# EAGLE design dekatron-sim-4017-a3 (EAGLE 7.3.0)
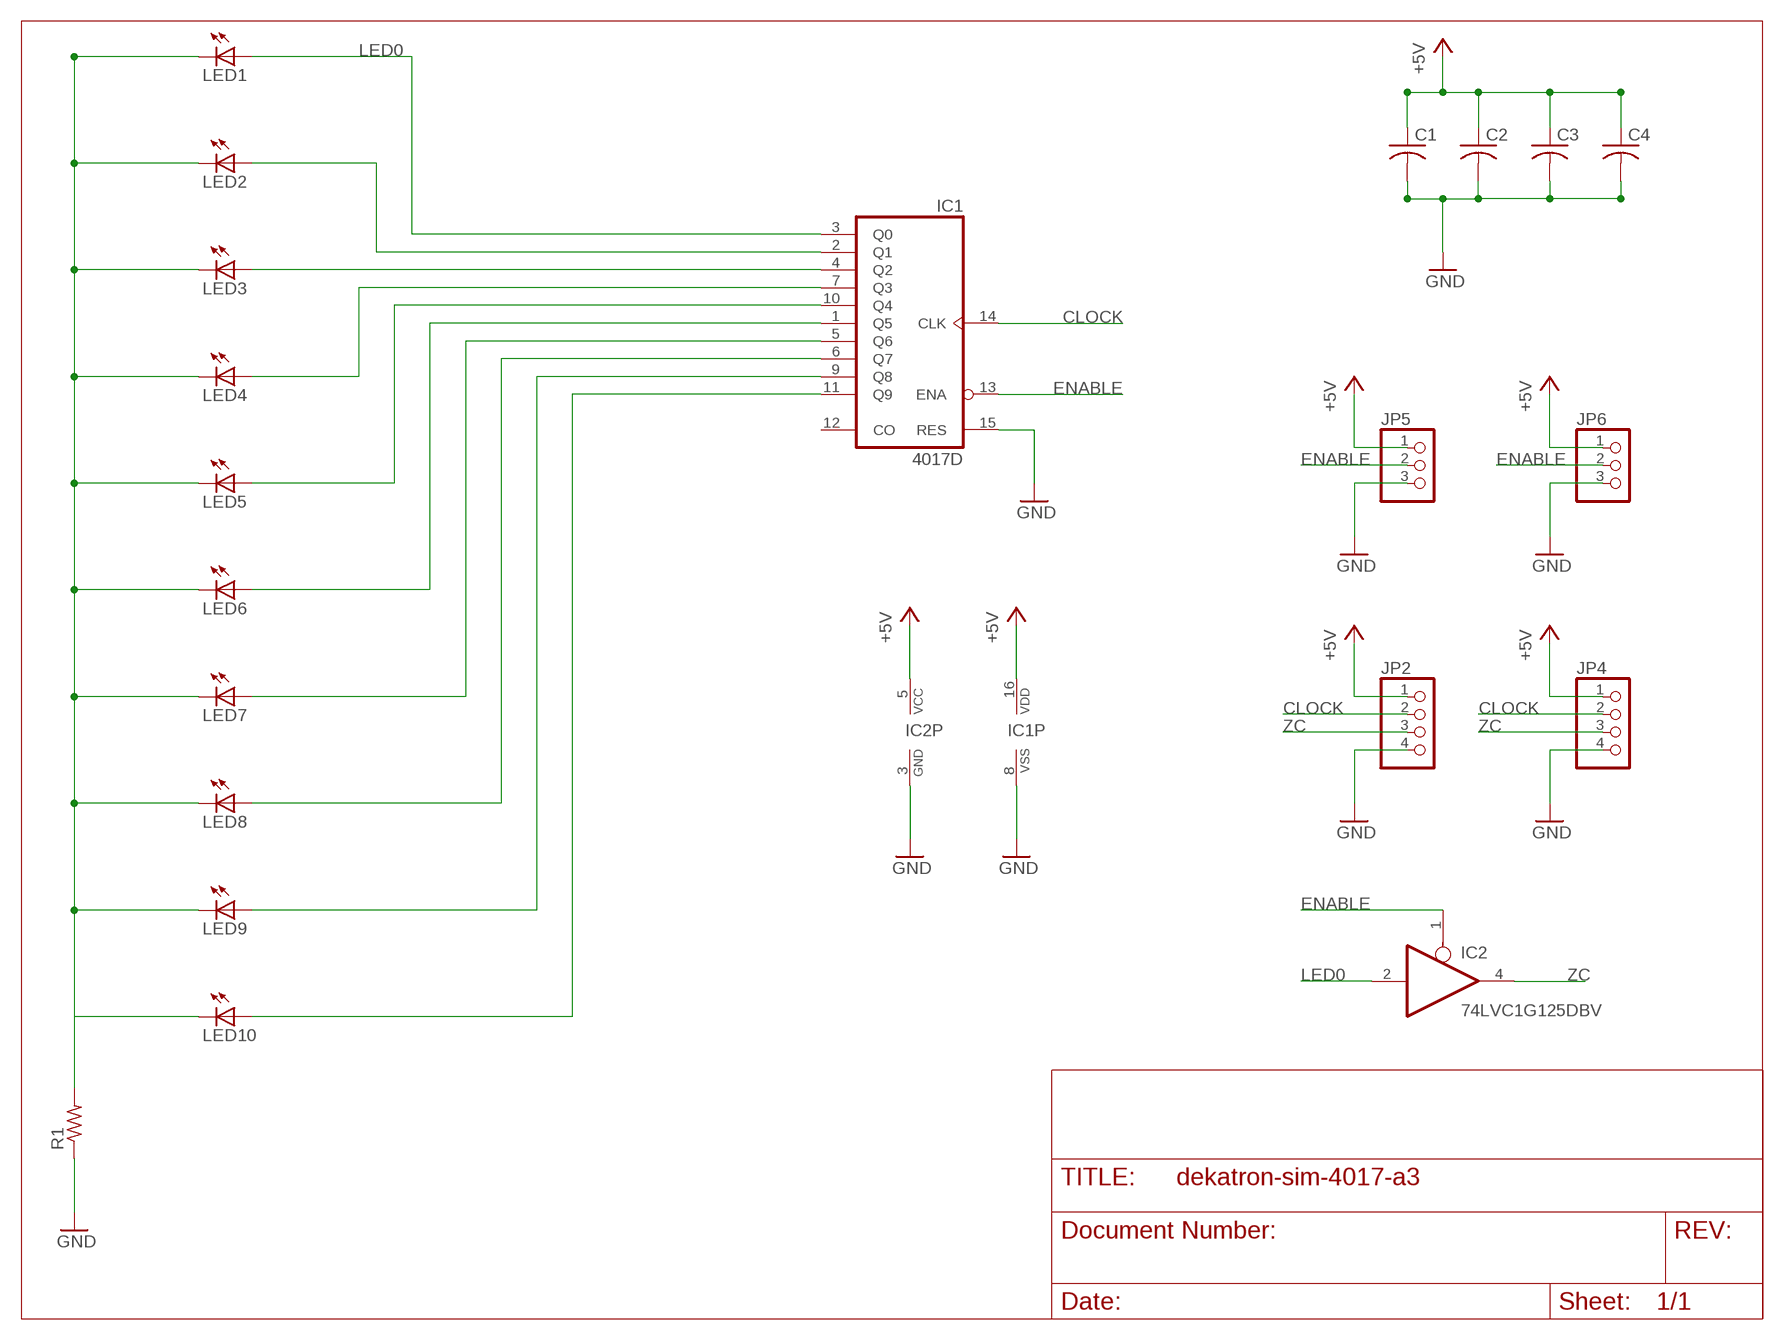
[diagram p0: schematic, sheet 1]

## Parts
C1  C-USC0805  [C0805]
C2  C-USC0805  [C0805]
C3  C-USC0805  [C0805]
C4  C-USC0805  [C0805]
IC1  4017D  [SO16]
IC2  74LVC1G125DBV  [SOT23-5]
JP2  PINHD-1X4  [1X04]
JP4  PINHD-1X4  [1X04]
JP5  PINHD-1X3  [1X03]
JP6  PINHD-1X3  [1X03]
LED1  RED  LEDCHIP-LED0805  [CHIP-LED0805]
LED2  RED  LEDCHIP-LED0805  [CHIP-LED0805]
LED3  RED  LEDCHIP-LED0805  [CHIP-LED0805]
LED4  RED  LEDCHIP-LED0805  [CHIP-LED0805]
LED5  RED  LEDCHIP-LED0805  [CHIP-LED0805]
LED6  RED  LEDCHIP-LED0805  [CHIP-LED0805]
LED7  RED  LEDCHIP-LED0805  [CHIP-LED0805]
LED8  RED  LEDCHIP-LED0805  [CHIP-LED0805]
LED9  RED  LEDCHIP-LED0805  [CHIP-LED0805]
LED10  RED  LEDCHIP-LED0805  [CHIP-LED0805]
R1  R-US_R0805  [R0805]

## Nets
+5V: C1.1 C2.1 C3.1 C4.1 IC1.16(VDD) IC2.5(VCC) JP2.1 JP4.1 JP5.1 JP6.1
CLOCK: IC1.14(CLK) JP2.2 JP4.2
ENABLE: IC1.13(ENA) IC2.1(OE) JP5.2 JP6.2
GND: C1.2 C2.2 C3.2 C4.2 IC1.8(VSS) IC1.15(RES) IC2.3(GND) JP2.4 JP4.4 JP5.3 JP6.3 R1.1
LED0: IC1.3(Q0) IC2.2(I) LED1.A
LED1: IC1.2(Q1) LED2.A
LED3: IC1.7(Q3) LED4.A
LED4: IC1.10(Q4) LED5.A
LED5: IC1.1(Q5) LED6.A
LED6: IC1.5(Q6) LED7.A
LED7: IC1.6(Q7) LED8.A
LED8: IC1.9(Q8) LED9.A
LED9: IC1.11(Q9) LED10.A
LED_SINK: LED1.C LED2.C LED3.C LED4.C LED5.C LED6.C LED7.C LED8.C LED9.C LED10.C R1.2
N$1: IC1.4(Q2) LED3.A
ZC: IC2.4(O) JP2.3 JP4.3
Unconnected: IC1.12(CO)

## Library data of the parts
C1-C4 = resistor:C-US: CAPACITOR, American symbol
IC1 = 40xx:4017: COUNTER/DIVIDER
IC2 = 74xx-little-us:74*1G125: Single Bus Buffer Gate with 3-State Output
JP2 JP4 = pinhead:PINHD-1X4: PIN HEADER
JP5 JP6 = pinhead:PINHD-1X3: PIN HEADER
LED1-LED10 = led:LED: LED OSRAM: - CHIPLED LG R971, LG N971, LY N971, LG Q971, LY Q971, LO R971, LY R971 LH N974, LH R974 LS Q976, LO Q976, LY Q976 LO Q996 - Hyper CHIPLED LW Q18S LB Q993, LB Q99A, LB R99A - SideLED LS A670, LO A670, LY A670, LG A670, LP A670 LB A673, LV A673, LT A673, LW A673 LH A674 LY A675 LS A676, LA A676, LO A676, LY A676, LW A676 LS A679, LY A679, LG A679 - Hyper Micro SIDELED® LS Y876, LA Y876, LO Y876, LY Y876 LT Y87S - SmartLED LW L88C, LW L88S LB L89C, LB L89S, LG L890 LS L89K, LO L89K, LY L89K LS L896, LA L896, LO L896, LY L896 - TOPLED LS T670, LO T670, LY T670, LG T670, LP T670 LSG T670, LSP T670, LSY T670, LOP T670, LYG T670 LG T671, LOG T671, LSG T671 LB T673, LV T673, LT T673, LW T673 LH T674 LS T676, LA T676, LO T676, LY T676, LB T676, LH T676, LSB T676, LW T676 LB T67C, LV T67C, LT T67C, LS T67K, LO T67K, LY T67K, LW E67C LS E67B, LA E67B, LO E67B, LY E67B, LB E67C, LV E67C, LT E67C LW T67C LS T679, LY T679, LG T679 LS T770, LO T770, LY T770, LG T770, LP T770 LB T773, LV T773, LT T773, LW T773 LH T774 LS E675, LA E675, LY E675, LS T675 LS T776, LA T776, LO T776, LY T776, LB T776 LHGB T686 LT T68C, LB T68C - Hyper Mini TOPLED® LB M676 - Mini TOPLED Santana® LG M470 LS M47K, LO M47K, LY M47K Source: http://www.osram.convergy.de LUXEON: - LUMILED® LXK2-PW12-R00, LXK2-PW12-S00, LXK2-PW14-U00, LXK2-PW14-V00 LXK2-PM12-R00, LXK2-PM12-S00, LXK2-PM14-U00 LXK2-PE12-Q00, LXK2-PE12-R00, LXK2-PE12-S00, LXK2-PE14-T00, LXK2-PE14-U00 LXK2-PB12-K00, LXK2-PB12-L00, LXK2-PB12-M00, LXK2-PB14-N00, LXK2-PB14-P00, LXK2-PB14-Q00 LXK2-PR12-L00, LXK2-PR12-M00, LXK2-PR14-Q00, LXK2-PR14-R00 LXK2-PD12-Q00, LXK2-PD12-R00, LXK2-PD12-S00 LXK2-PH12-R00, LXK2-PH12-S00 LXK2-PL12-P00, LXK2-PL12-Q00, LXK2-PL12-R00 Source: www.luxeon.com KINGBRIGHT: KA-3528ASYC Source: www.kingbright.com
R1 = resistor:R-US_: RESISTOR, American symbol

## Board
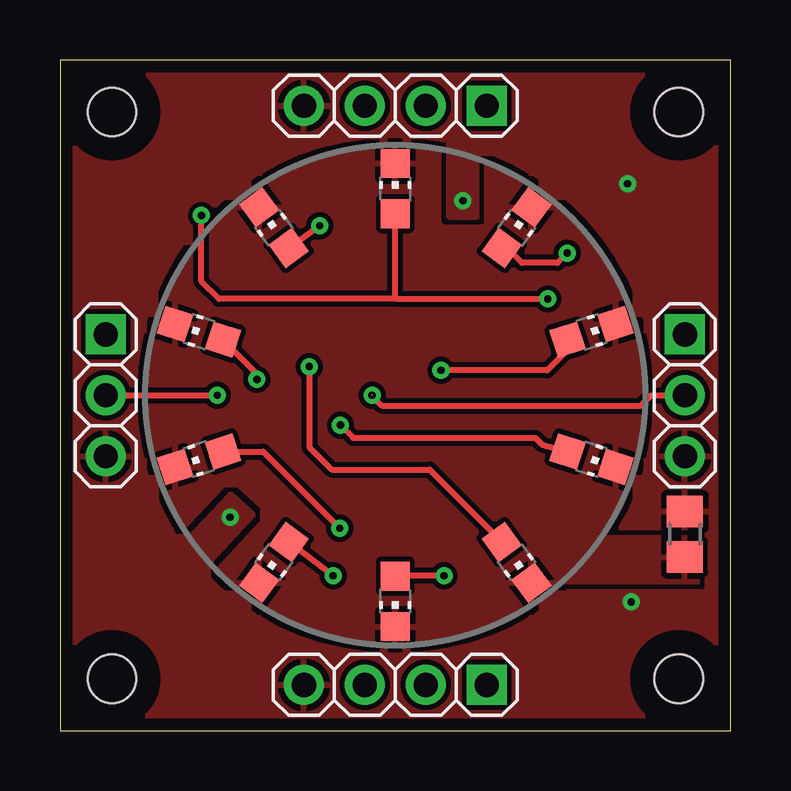
[diagram p1: board, top side]
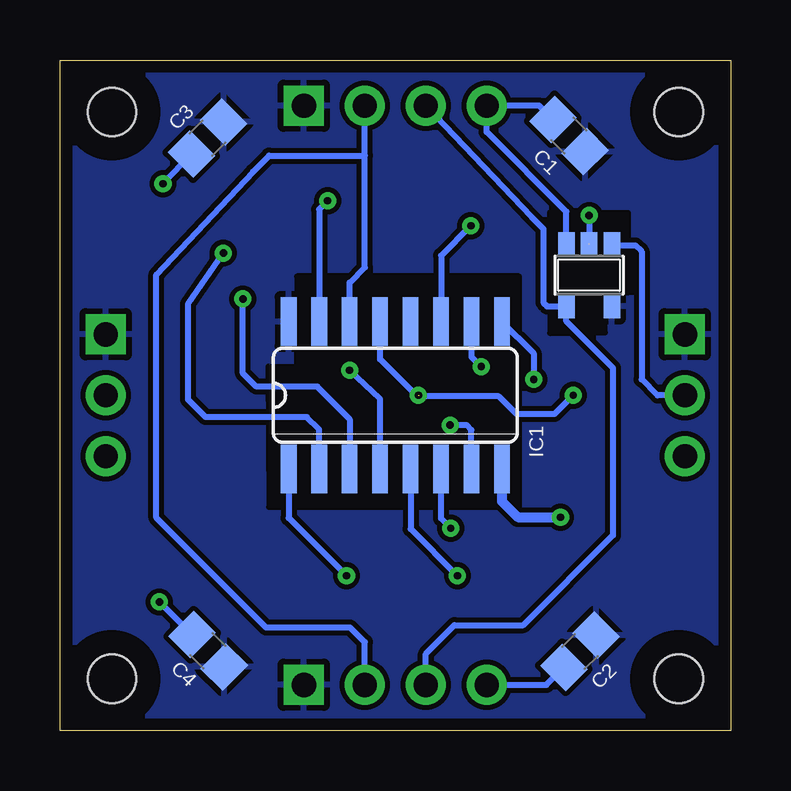
[diagram p2: board, bottom side, seen from below]

Size 27.94 x 27.94 mm. Coordinates in mm from the lower left corner, seen from the top.
Outline: 27.94,27.94 0,27.94 0,0 27.94,0 27.94,27.94
Copper layers (1*16): Top 0.035mm / dielectric 1.5mm / Bottom 0.035mm
Design rules "default *": minimum track width 8mil, minimum drill 12mil, track to track 8mil, track to pad 10mil, pad to pad 10mil, via to via 8mil, smd to smd 8mil, copper to edge 20mil, drill to drill 8mil, minimum pad ring 10mil, minimum via ring 8mil, stop-mask expansion 4mil, vias tented up to drill 0mil, thermal gap 10mil
Holes 2.01 mm at 2.16,2.16 25.78,2.16 25.78,25.78 2.16,25.78
tRestrict: area 23.8,0.2 to 27.8,4.2; area 23.8,23.8 to 27.8,27.8; area 0.2,23.8 to 4.2,27.8; area 0.2,0.2 to 4.2,4.2
bRestrict: area 23.8,0.2 to 27.8,4.2; area 23.8,23.8 to 27.8,27.8; area 0.2,23.8 to 4.2,27.8; area 0.2,0.2 to 4.2,4.2; area 8.8,9.3 to 19.3,18.9; area 4.3,16.6 to 7.5,21.6

### Footprints (pad centres in the part's own frame; a part is rotated, then mirrored left to right if it is on the bottom)
C0805 = smd 1.3 x 1.5: 1 -0.95,0; 2 0.95,0
SO16 = smd 0.66 x 2.032: 1 -4.445,-3.073; 2 -3.175,-3.073; 3 -1.905,-3.073; 4 -0.635,-3.073; 5 0.635,-3.073; 6 1.905,-3.073; 7 3.175,-3.073; 8 4.445,-3.073; 9 4.445,3.073; 10 3.175,3.073; 11 1.905,3.073; 12 0.635,3.073; 13 -0.635,3.073; 14 -1.905,3.073; 15 -3.175,3.073; 16 -4.445,3.073
SOT23-5 = smd 0.69 x 0.99: 1 -0.95,-1.29; 2 0,-1.29; 3 0.95,-1.29; 4 0.95,1.3; 5 -0.95,1.3
1X04 = drill 1.016 pad 1.676 square: 1 -3.81,0 | drill 1.016 pad 1.676: 2 -1.27,0; 3 1.27,0; 4 3.81,0
1X03 = drill 1.016 pad 1.676 square: 1 -2.54,0 | drill 1.016 pad 1.676: 2 0,0; 3 2.54,0
CHIP-LED0805 = smd 1.2 x 1.2: A 0,-1.05; C 0,1.05
R0805 = smd 1.3 x 1.5: 1 -0.95,0; 2 0.95,0

### Placement (x,y rotation side)
C1  6.73,24.79 135 bottom
C2  6.27,3.3 225 bottom
C3  21.79,24.69 225 bottom
C4  21.77,3.33 135 bottom
IC1  13.97,13.97 0 bottom
IC2  5.89,18.97 180 bottom
JP2  13.97,26.04 180 top
JP4  13.97,1.91 180 top
JP5  1.91,13.97 270 top
JP6  26.04,13.97 270 top
LED1  13.97,22.58 0 top
LED2  19.02,20.95 324 top
LED3  22.15,16.61 288 top
LED4  22.15,11.3 252 top
LED5  19.02,7.01 216 top
LED6  13.97,5.38 180 top
LED7  8.92,7.01 144 top
LED8  5.79,11.3 108 top
LED9  5.79,16.61 72 top
LED10  8.92,20.95 36 top
R1  26.04,8.18 270 top

### Tracks (layer width: path | path; a pad name or v marks a point on that pad's centre or on a via)
+5V
  pour Bottom: 27.69,0.25 0.25,0.25 0.25,27.69 27.69,27.69
CLOCK
  Bottom 0.254: JP4.2 15.24,3.68 15.85,4.29 19.36,4.29 23.93,8.87 23.93,19 19.89,23.29 19.23,23.95 15.24,23.95 | IC1.14 15.88,18.67 15.24,19.3 15.24,23.95 | 15.24,23.95 JP2.2
ENABLE  (via drill 0.3)  (1 unrouted)
  Top 0.254: JP5.2 v6.55,13.97 | 12.98,13.97 13.41,13.54 24.21,13.54 24.64,13.97 JP6.2
  Bottom 0.254: IC2.1 4.9,20.22 3.96,20.22 3.71,19.96 3.71,14.63 3.05,13.97 JP5.2 | IC1.13 14.61,15.47 13.11,13.97 v13.01,13.97 12.95,13.92 9.65,13.92 8.91,13.18 7.34,13.18 v6.55,13.97
GND  (via drill 0.3)
  Bottom 0.254: C4.2 v23.8,5.36 | v23.8,5.36 | C3.2 v23.65,22.78 | C1.2 7.98,26.04 JP2.4 10.16,24.94 6.84,21.63 IC2.3 | JP4.4 7.67,1.91 C2.2 | v16.79,22.07 17.14,21.72 IC1.15
  Bottom 0.406: IC1.8 9.53,9.55 8.87,8.89 v7.09,8.89
  pour Top (rank 6): 27.69,0.25 0.25,0.25 0.25,27.69 27.69,27.69
  pour Top (rank 2): 16.21,21.41 17.37,21.41 17.37,24.64 16.21,24.64
  pour Top (rank 2): 7.11,9.86 8.05,8.99 5.18,5.89 4.22,6.78
LED0  (via drill 0.3)
  Top 0.254: LED1.A 13.97,18.06 14.05,17.98 | 14.05,17.98 6.63,17.98 5.89,18.72 v5.89,21.46 | 14.05,17.98 v20.32,17.98
  Bottom 0.254: v5.89,21.46 IC2.2 | IC1.3 15.88,12.98 17.22,14.33 19.76,14.33 20.32,14.88 v20.32,17.98
LED1  (via drill 0.3)
  Top 0.254: v21.13,19.89 20.72,19.48 19.25,19.48 18.63,20.11 LED2.A
  Bottom 0.254: IC1.2 17.14,12.55 17.65,13.06 21.87,13.06 22.61,13.79 22.61,17.78 v21.13,19.89
LED3  (via drill 0.3)
  Top 0.254: 20.99,11.79 LED4.A 20.09,11.91 19.81,12.19 12.22,12.19 v11.68,12.72
  Bottom 0.254: IC1.7 10.79,12.52 11,12.72 v11.68,12.72
LED4  (via drill 0.3)
  Top 0.254: LED5.A 15.4,10.87 11.33,10.87 10.39,11.81 v10.39,15.16
  Bottom 0.254: IC1.10 10.79,15.57 v10.39,15.16
LED5  (via drill 0.3)
  Top 0.254: v16,6.45 14.01,6.45 LED6.A
  Bottom 0.254: IC1.1 18.41,8.87 v16,6.45
LED6  (via drill 0.3)
  Top 0.254: 9.55,7.88 LED7.A v11.38,6.45
  Bottom 0.254: IC1.5 13.34,8.41 v11.38,6.45
LED7  (via drill 0.3)
  Top 0.254: LED8.A 8.46,11.63 v11.66,8.43
  Bottom 0.254: IC1.6 12.06,8.84 v11.66,8.43
LED8  (via drill 0.3)
  Top 0.254: LED9.A 8.2,14.87 v8.2,14.63
  Bottom 0.254: IC1.9 8.2,15.72 v8.2,14.63
LED9  (via drill 0.3)
  Top 0.254: v10.82,21.03 LED10.A
  Bottom 0.254: v10.82,21.03 12.06,19.79 IC1.11
LED_SINK
  Top 0.254: LED9.C 4.8,16.93
  pour Top: 26.54,8.03 26.54,6.17 20.6,6.2 20.6,8.05
  pour Top (rank 4): 13.97,24.38 arc-90 24.38,13.97 arc-90 13.97,3.56 arc-90 3.56,13.97 arc-90
N$1  (via drill 0.3)
  Top 0.254: LED3.A 21.36,16.08 20.3,15.01 v15.88,15.01
  Bottom 0.254: IC1.4 14.61,13.82 v15.88,15.01
ZC
  Bottom 0.254: JP4.3 12.7,3.2 11.51,4.39 8.64,4.39 4.9,8.13 4.9,15.11 6.84,17.05 IC2.4 | JP2.3 8.28,21.39 7.8,20.9 7.8,17.83 7.64,17.68 IC2.4 | IC2.4

### Text on the board
Document: DEKATRON / SIMULATOR
tDocu: 0 | 9 | 1 | 8 | 2 | 7 | 3 | 4 | 6 | 5